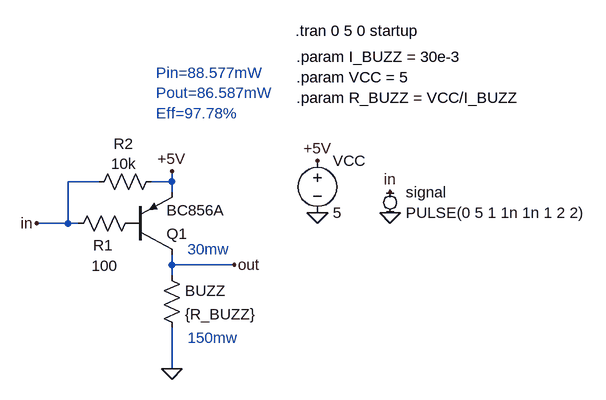
[diagram p0: schematic buzzer.asc]
buzzer.asc, the LTspice schematic file:
Version 4
SHEET 1 880 680
WIRE 64 0 16 0
WIRE 176 0 176 -16
WIRE 176 0 144 0
WIRE 176 16 176 0
WIRE 16 64 16 0
WIRE 16 64 -32 64
WIRE 32 64 16 64
WIRE 176 128 176 112
WIRE 272 128 176 128
WIRE 176 144 176 128
WIRE 176 288 176 224
FLAG 400 -32 +5V
FLAG 400 48 0
FLAG 176 288 0
FLAG 176 -16 +5V
FLAG 512 16 in
FLAG 512 48 0
FLAG -32 64 in
FLAG 272 128 out
SYMBOL pnp 112 112 M180
SYMATTR InstName Q1
SYMATTR Value BC856A
SYMBOL res 128 48 R90
WINDOW 0 65 58 VBottom 2
WINDOW 3 66 55 VTop 2
SYMATTR InstName R1
SYMATTR Value 100
SYMBOL res 160 128 R0
SYMATTR InstName BUZZ
SYMATTR Value {R_BUZZ}
SYMBOL voltage 400 -48 R0
SYMATTR InstName VCC
SYMATTR Value 5
SYMBOL MiniSyms4\\voltage- 512 32 R0
WINDOW 123 0 0 Left 0
WINDOW 39 0 0 Left 0
SYMATTR InstName signal
SYMATTR Value PULSE(0 5 1 1n 1n 1 2 2)
SYMBOL res 160 -16 R90
WINDOW 0 -27 58 VBottom 2
WINDOW 3 -27 58 VTop 2
SYMATTR InstName R2
SYMATTR Value 10k
TEXT 368 -192 Left 2 !.param I_BUZZ = 30e-3\n.param VCC = 5\n.param R_BUZZ = VCC/I_BUZZ
TEXT 366 -232 Left 2 !.tran 0 5 0 startup
TEXT 200 240 Left 2 ;150mw
TEXT 200 104 Left 2 ;30mw
TEXT 152 -168 Left 2 ;Pin=88.577mW\nPout=86.587mW\nEff=97.78%

The netlist it stands for:
* buzzer.asc
Q1 out P001 +5V 0 BC856A
R1 P001 in 100
R§BUZZ out 0 {R_BUZZ}
VCC +5V 0 5
V§signal in 0 PULSE(0 5 1 1n 1n 1 2 2)
R2 +5V in 10k
.model NPN NPN
.model PNP PNP
.lib standard.bjt
.param I_BUZZ = 30e-3
.param VCC = 5
.param R_BUZZ = VCC/I_BUZZ
.tran 0 5 0 startup
* 150mw
* 30mw
* Pin=88.577mW
* Pout=86.587mW
* Eff=97.78%
.backanno
.end